# EAGLE board MainBoard (EAGLE 9.7.0)
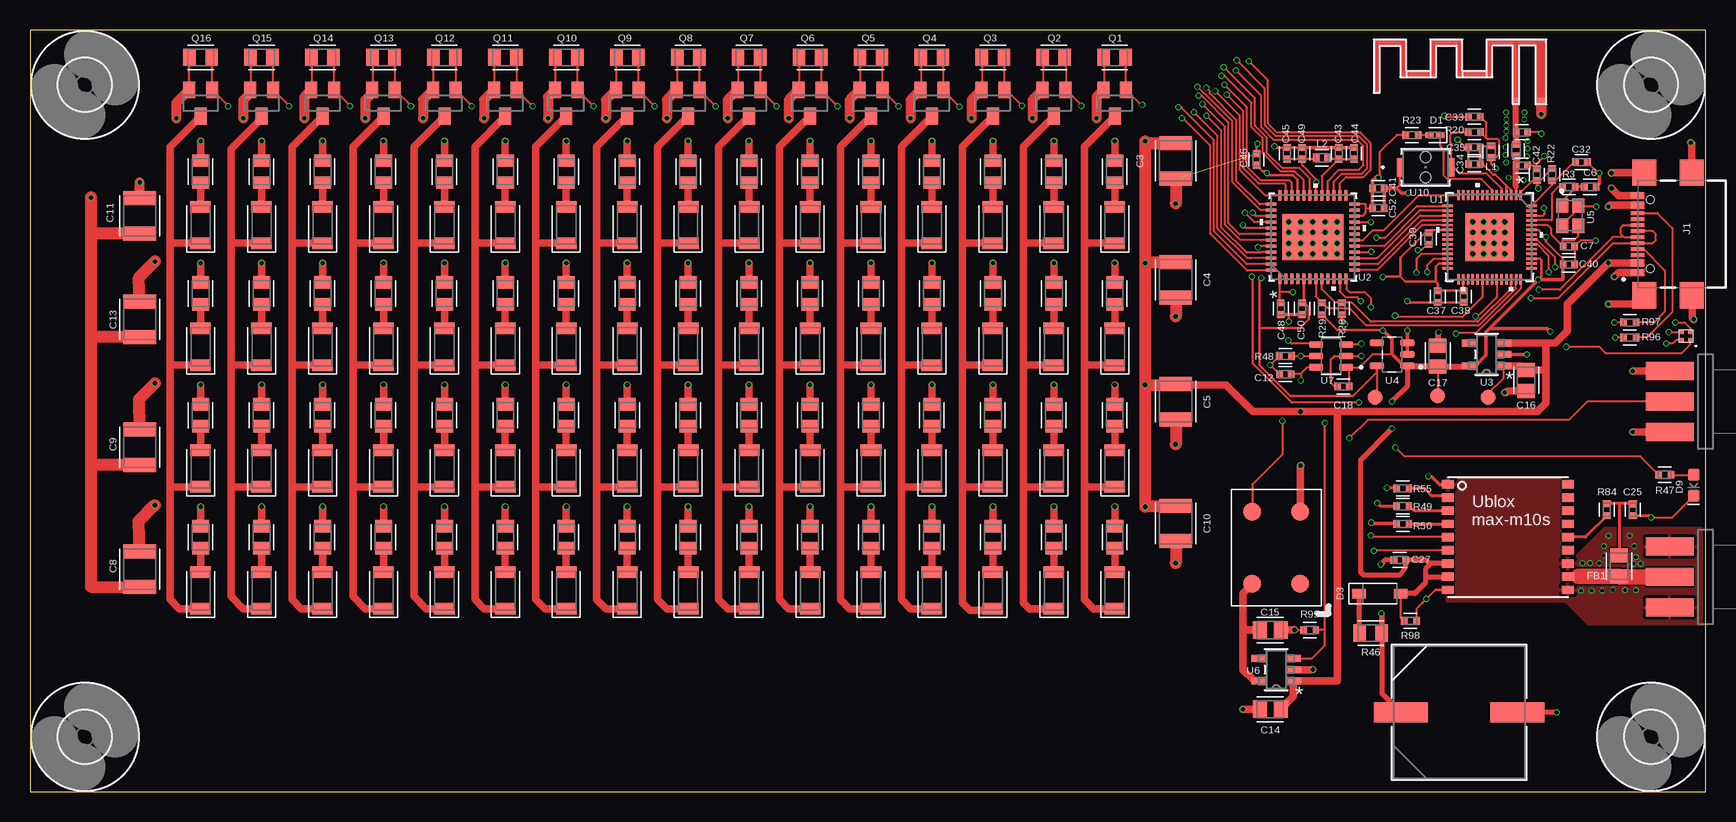
[diagram p2: board, top side]
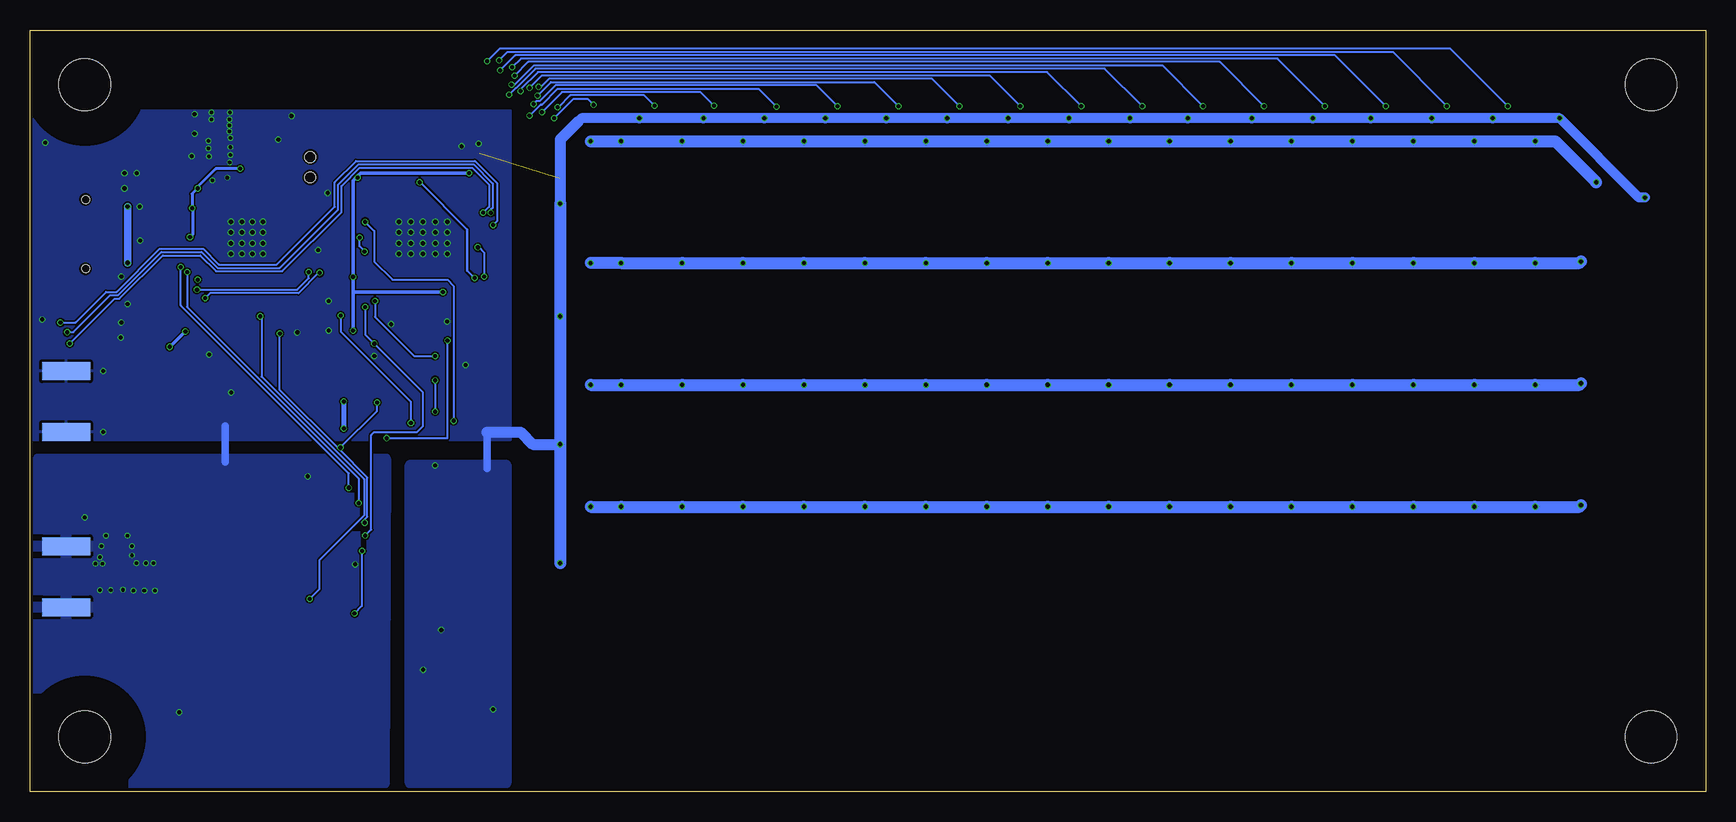
[diagram p3: board, bottom side, seen from below]

Size 139.7 x 63.5 mm. Coordinates in mm from the lower left corner, seen from the top.
Outline: 139.7,63.5 0,63.5 0,0 139.7,0 139.7,63.5
Copper layers (1*16): Top 0.035mm / dielectric 1.6mm / Bottom 0.035mm
Design rules "jlcpcb-2layers.dru": minimum track width 5mil, minimum drill 0.3mm, track to track 5mil, track to pad 5mil, pad to pad 5mil, via to via 5mil, smd to smd 5mil, copper to edge 0.2mm, drill to drill 6mil, minimum pad ring 10mil, minimum via ring 3mil, stop-mask expansion 4mil, vias tented up to drill 0mil, thermal gap 10mil

## Footprints (pad centres in the part's own frame; a part is rotated, then mirrored left to right if it is on the bottom)
CAPC1005X60 = smd 0.56 x 0.629: 1 -0.485,0; 2 0.485,0
CAPC3225X135 = smd 1.165 x 2.715: 1 -1.475,0; 2 1.475,0
CAPC2012X110 = smd 1.165 x 1.465: 1 -0.875,0; 2 0.875,0
FC0H473ZFTBR24_KEM = smd 4.496 x 1.702: 1 -4.864,0; 2 4.864,0
LEDC1005X25N_FLAT-B = smd 0.7 x 0.5: A 0.45,0; C -0.45,0
LEDC3216X180N_RND-B = smd 0.962 x 1.712: A 1.525,0; C -1.525,0
SOD3715X135 = smd 1.127 x 0.784: 1 -1.722,0; 2 1.722,0
LED-0603 = smd 1 x 1: A -0.877,0; C 0.877,0
SMA-EDGE = smd 1.5 x 4: GND@0 -2.54,0; GND@1 2.54,0; SIG 0,0 | smd 1.5 x 4 bottom: GND@2 -2.54,0; GND@3 2.54,0
BEADC2012X105N = smd 1.165 x 1.465: 1 -0.875,0; 2 0.875,0
4,3 = hole 4.3: 0,0
GCT_USB4110GFA = smd 0.6 x 1.15: A1/B12 -3.2,1.075; A4/B9 -2.4,1.075; B1/A12 3.2,1.075; B4/A9 2.4,1.075 | smd 0.3 x 1.15: A5 -1.25,1.075; A6 -0.25,1.075; A7 0.25,1.075; A8 1.25,1.075; B5 1.75,1.075; B6 0.75,1.075; B7 -0.75,1.075; B8 -1.75,1.075 | smd 2.18 x 2: S1 -5.11,0.5; S2 5.11,0.5; S3 -5.11,-3.43; S4 5.11,-3.43 | hole 0.65: -2.89,0; 2.89,0
INDC1006X60N = smd 0.56 x 0.729: 1 -0.485,0; 2 0.485,0
SOT23 = smd 1 x 1.4: 1 -0.95,-1.1; 2 0.95,-1.1; 3 0,1.1
RESC2012X65 = smd 1.031 x 1.42: 1 -0.919,0; 2 0.919,0
RESC1005X40 = smd 0.535 x 0.644: 1 -0.507,0; 2 0.507,0
B1,27 = smd 1.27 x 1.27: TP 0,0
QFN56_ESP32-S2FH4_EXP-M = smd 0.864 x 0.203: 1 -3.505,2.6; 2 -3.505,2.2; 3 -3.505,1.8; 4 -3.505,1.4; 5 -3.505,1; 6 -3.505,0.6; 7 -3.505,0.2; 8 -3.505,-0.2; 9 -3.505,-0.6; 10 -3.505,-1; 11 -3.505,-1.4; 12 -3.505,-1.8; 13 -3.505,-2.2; 14 -3.505,-2.6; 29 3.505,-2.6; 30 3.505,-2.2; 31 3.505,-1.8; 32 3.505,-1.4; 33 3.505,-1; 34 3.505,-0.6; 35 3.505,-0.2; 36 3.505,0.2; 37 3.505,0.6; 38 3.505,1; 39 3.505,1.4; 40 3.505,1.8; 41 3.505,2.2; 42 3.505,2.6 | smd 0.203 x 0.864: 15 -2.6,-3.505; 16 -2.2,-3.505; 17 -1.8,-3.505; 18 -1.4,-3.505; 19 -1,-3.505; 20 -0.6,-3.505; 21 -0.2,-3.505; 22 0.2,-3.505; 23 0.6,-3.505; 24 1,-3.505; 25 1.4,-3.505; 26 1.8,-3.505; 27 2.2,-3.505; 28 2.6,-3.505; 43 2.6,3.505; 44 2.2,3.505; 45 1.8,3.505; 46 1.4,3.505; 47 1,3.505; 48 0.6,3.505; 49 0.2,3.505; 50 -0.2,3.505; 51 -0.6,3.505; 52 -1,3.505; 53 -1.4,3.505; 54 -1.8,3.505; 55 -2.2,3.505; 56 -2.6,3.505 | smd 4.039 x 4.039: 57 0,0
ICE40-QFN = smd 0.864 x 0.254: 1 -3.48,2.75; 2 -3.48,2.25; 3 -3.48,1.75; 4 -3.48,1.25; 5 -3.48,0.75; 6 -3.48,0.25; 7 -3.48,-0.25; 8 -3.48,-0.75; 9 -3.48,-1.25; 10 -3.48,-1.75; 11 -3.48,-2.25; 12 -3.48,-2.75; 25 3.48,-2.75; 26 3.48,-2.25; 27 3.48,-1.75; 28 3.48,-1.25; 29 3.48,-0.75; 30 3.48,-0.25; 31 3.48,0.25; 32 3.48,0.75; 33 3.48,1.25; 34 3.48,1.75; 35 3.48,2.25; 36 3.48,2.75 | smd 0.254 x 0.864: 13 -2.75,-3.48; 14 -2.25,-3.48; 15 -1.75,-3.48; 16 -1.25,-3.48; 17 -0.75,-3.48; 18 -0.25,-3.48; 19 0.25,-3.48; 20 0.75,-3.48; 21 1.25,-3.48; 22 1.75,-3.48; 23 2.25,-3.48; 24 2.75,-3.48; 37 2.75,3.48; 38 2.25,3.48; 39 1.75,3.48; 40 1.25,3.48; 41 0.75,3.48; 42 0.25,3.48; 43 -0.25,3.48; 44 -0.75,3.48; 45 -1.25,3.48; 46 -1.75,3.48; 47 -2.25,3.48; 48 -2.75,3.48 | smd 3.81 x 5.08: PAD 0,0
TSOP5_3X1P5_ONS-M = smd 1.233 x 0.559: 1 -1.442,0.95; 2 -1.442,0; 3 -1.442,-0.95; 4 1.442,-0.95; 5 1.442,0.95
TPS76912DBVR = smd 1.21 x 0.59: 1 -1.255,0.95; 2 -1.255,0; 3 -1.255,-0.95; 4 1.255,-0.95; 5 1.255,0.95
XTAL_ECS-400-10-36-CKY-TR = smd 1.2 x 1: GND-A -0.85,0.65; GND-B 0.85,-0.65; IN/OUT -0.85,-0.65; OUT/IN 0.85,0.65
SOT95P280X145-6N = smd 1.21 x 0.58: 1 -1.255,0.95; 2 -1.255,0; 3 -1.255,-0.95; 4 1.255,-0.95; 5 1.255,0; 6 1.255,0.95
RGBLED = smd 0.3 x 0.3: P$1 0.33,0.33; P$2 0.33,-0.33; P$3 -0.33,-0.33; P$4 -0.33,0.33
SW_CS1213AGF260_CRS = smd 0.508 x 1.524: 1 -2.159,0; 2 2.159,0 | hole 0.889: 0,0.85; 0,-0.85
MAX-M10S-00B = smd 1 x 0.7: P$1 -5,4.4; P$2 -5,3.3; P$3 -5,2.2; P$4 -5,1.1; P$5 -5,0; P$6 -5,-1.1; P$7 -5,-2.2; P$8 -5,-3.3; P$9 -5,-4.4; P$10 5,-4.4; P$11 5,-3.3; P$12 5,-2.2; P$13 5,-1.1; P$14 5,0; P$15 5,1.1; P$16 5,2.2; P$17 5,3.3; P$18 5,4.4
PCB-ANTENNA = smd 0.9 x 0.5: P$1 0.075,-1.65 | smd 0.5 x 0.5: P$2 2.175,-1.65
ACO97 = smd 1.5 x 1.5: DNC -3,-2; GND 3,-2; OUT 3,2; VDD -3,2

## Placement (x,y rotation side)
C1  3.3pF  [CAPC1005X60]  124.36,52.2 0 top
C2  3.3pF  [CAPC1005X60]  124.36,54.97 0 top
C3  22uF  [CAPC3225X135]  95.5,52.58 270 top
C4  22uF  [CAPC3225X135]  95.5,42.67 270 top
C5  22uF  [CAPC3225X135]  95.5,32.51 270 top
C6  12pF  [CAPC1005X60]  130.05,50.42 0 top
C7  12pF  [CAPC1005X60]  128.27,45.47 0 top
C8  22uF  [CAPC3225X135]  9.14,18.54 270 top
C9  22uF  [CAPC3225X135]  9.14,28.7 270 top
C10  22uF  [CAPC3225X135]  95.5,22.35 270 top
C11  22uF  [CAPC3225X135]  9.14,48.01 270 top
C12  1uF  [CAPC1005X60]  104.65,34.8 180 top
C13  22uF  [CAPC3225X135]  9.14,39.37 270 top
C14  1uF  [CAPC2012X110]  103.38,6.86 180 top
C15  1uF  [CAPC2012X110]  103.38,13.46 0 top
C16  1uF  [CAPC2012X110]  124.71,34.29 270 top
C17  1uF  [CAPC2012X110]  117.35,36.32 90 top
C18  1uF  [CAPC1005X60]  109.47,33.78 180 top
C20  FC0H473ZFTBR24FC0H473ZFTBR24_KEM  [FC0H473ZFTBR24_KEM]  119.13,6.6 0 top
C25  47pF  [CAPC1005X60]  133.6,23.5 270 top
C27  4.7uF  [CAPC1005X60]  114.17,19.3 180 top
C32  1uF  [CAPC1005X60]  129.32,52.49 0 top
C33  10uF  [CAPC1005X60]  120.4,56.26 180 top
C34  10uF  [CAPC1005X60]  120.4,52.32 180 top
C35  0.1uF  [CAPC1005X60]  120.4,53.72 180 top
C37  0.1uF  [CAPC1005X60]  117.35,41.27 270 top
C38  0.1uF  [CAPC1005X60]  119.51,41.27 270 top
C39  0.1uF  [CAPC1005X60]  116.59,46.1 270 top
C40  0.1uF  [CAPC1005X60]  128.27,43.94 0 top
C41  0.1uF  [CAPC1005X60]  112.39,50.29 0 top
C42  0.1uF  [CAPC1005X60]  125.6,51.44 90 top
C43  10uF  [CAPC1005X60]  109.09,53.21 90 top
C44  0.1uF  [CAPC1005X60]  110.36,53.21 90 top
C45  10uF  [CAPC1005X60]  104.78,53.21 90 top
C46  0.1uF  [CAPC1005X60]  102.23,52.7 90 top
C48  0.1uF  [CAPC1005X60]  104.27,40.26 270 top
C49  0.1uF  [CAPC1005X60]  106.05,53.21 90 top
C50  0.1uF  [CAPC1005X60]  106.05,40.26 270 top
C52  0.1uF  [CAPC1005X60]  112.39,48.64 0 top
D1  LED_BLUE  [LEDC1005X25N_FLAT-B]  117.09,54.74 180 top
D2  LED_BLUE  [LEDC3216X180N_RND-B]  39.62,47.24 90 top
D3  1N4148W  [SOD3715X135]  112.52,16.51 0 top
D4  LED_BLUE  [LEDC3216X180N_RND-B]  90.42,47.24 90 top
D5  LED_BLUE  [LEDC3216X180N_RND-B]  90.42,37.08 90 top
D6  LED_BLUE  [LEDC3216X180N_RND-B]  90.42,26.92 90 top
D7  LED_BLUE  [LEDC3216X180N_RND-B]  90.42,16.76 90 top
D8  LED_BLUE  [LEDC3216X180N_RND-B]  39.62,37.08 90 top
D9  [LED-0603]  138.68,25.53 270 top
D10  LED_BLUE  [LEDC3216X180N_RND-B]  39.62,26.92 90 top
D11  LED_BLUE  [LEDC3216X180N_RND-B]  39.62,16.76 90 top
D12  LED_BLUE  [LEDC3216X180N_RND-B]  85.34,26.92 90 top
D13  LED_BLUE  [LEDC3216X180N_RND-B]  85.34,47.24 90 top
D14  LED_BLUE  [LEDC3216X180N_RND-B]  85.34,16.76 90 top
D15  LED_BLUE  [LEDC3216X180N_RND-B]  85.34,37.08 90 top
D16  LED_BLUE  [LEDC3216X180N_RND-B]  34.54,47.24 90 top
D17  LED_BLUE  [LEDC3216X180N_RND-B]  34.54,37.08 90 top
D18  LED_BLUE  [LEDC3216X180N_RND-B]  34.54,26.92 90 top
D19  LED_BLUE  [LEDC3216X180N_RND-B]  34.54,16.76 90 top
D20  LED_BLUE  [LEDC3216X180N_RND-B]  80.26,16.76 90 top
D21  LED_BLUE  [LEDC3216X180N_RND-B]  80.26,37.08 90 top
D22  LED_BLUE  [LEDC3216X180N_RND-B]  80.26,47.24 90 top
D23  LED_BLUE  [LEDC3216X180N_RND-B]  80.26,26.92 90 top
D24  LED_BLUE  [LEDC3216X180N_RND-B]  29.46,16.76 90 top
D25  LED_BLUE  [LEDC3216X180N_RND-B]  29.46,26.92 90 top
D26  LED_BLUE  [LEDC3216X180N_RND-B]  29.46,37.08 90 top
D27  LED_BLUE  [LEDC3216X180N_RND-B]  29.46,47.24 90 top
D28  LED_BLUE  [LEDC3216X180N_RND-B]  75.18,16.76 90 top
D29  LED_BLUE  [LEDC3216X180N_RND-B]  75.18,37.08 90 top
D30  LED_BLUE  [LEDC3216X180N_RND-B]  75.18,26.92 90 top
D31  LED_BLUE  [LEDC3216X180N_RND-B]  75.18,47.24 90 top
D32  LED_BLUE  [LEDC3216X180N_RND-B]  24.38,16.76 90 top
D33  LED_BLUE  [LEDC3216X180N_RND-B]  24.38,26.92 90 top
D34  LED_BLUE  [LEDC3216X180N_RND-B]  24.38,37.08 90 top
D35  LED_BLUE  [LEDC3216X180N_RND-B]  24.38,47.24 90 top
D36  LED_BLUE  [LEDC3216X180N_RND-B]  70.1,26.92 90 top
D37  LED_BLUE  [LEDC3216X180N_RND-B]  70.1,16.76 90 top
D38  LED_BLUE  [LEDC3216X180N_RND-B]  70.1,37.08 90 top
D39  LED_BLUE  [LEDC3216X180N_RND-B]  70.1,47.24 90 top
D40  LED_BLUE  [LEDC3216X180N_RND-B]  19.3,37.08 90 top
D41  LED_BLUE  [LEDC3216X180N_RND-B]  19.3,16.76 90 top
D42  LED_BLUE  [LEDC3216X180N_RND-B]  19.3,26.92 90 top
D43  LED_BLUE  [LEDC3216X180N_RND-B]  19.3,47.24 90 top
D44  LED_BLUE  [LEDC3216X180N_RND-B]  65.02,47.24 90 top
D45  LED_BLUE  [LEDC3216X180N_RND-B]  65.02,37.08 90 top
D46  LED_BLUE  [LEDC3216X180N_RND-B]  65.02,26.92 90 top
D47  LED_BLUE  [LEDC3216X180N_RND-B]  65.02,16.76 90 top
D48  LED_BLUE  [LEDC3216X180N_RND-B]  14.22,16.76 90 top
D49  LED_BLUE  [LEDC3216X180N_RND-B]  14.22,37.08 90 top
D50  LED_BLUE  [LEDC3216X180N_RND-B]  14.22,26.92 90 top
D51  LED_BLUE  [LEDC3216X180N_RND-B]  14.22,47.24 90 top
D52  LED_BLUE  [LEDC3216X180N_RND-B]  59.94,47.24 90 top
D53  LED_BLUE  [LEDC3216X180N_RND-B]  59.94,37.08 90 top
D54  LED_BLUE  [LEDC3216X180N_RND-B]  59.94,26.92 90 top
D55  LED_BLUE  [LEDC3216X180N_RND-B]  59.94,16.76 90 top
D60  LED_BLUE  [LEDC3216X180N_RND-B]  54.86,26.92 90 top
D61  LED_BLUE  [LEDC3216X180N_RND-B]  54.86,16.76 90 top
D62  LED_BLUE  [LEDC3216X180N_RND-B]  54.86,47.24 90 top
D63  LED_BLUE  [LEDC3216X180N_RND-B]  54.86,37.08 90 top
D68  LED_BLUE  [LEDC3216X180N_RND-B]  49.78,16.76 90 top
D69  LED_BLUE  [LEDC3216X180N_RND-B]  49.78,26.92 90 top
D70  LED_BLUE  [LEDC3216X180N_RND-B]  49.78,37.08 90 top
D71  LED_BLUE  [LEDC3216X180N_RND-B]  49.78,47.24 90 top
D76  LED_BLUE  [LEDC3216X180N_RND-B]  44.7,26.92 90 top
D77  LED_BLUE  [LEDC3216X180N_RND-B]  44.7,37.08 90 top
D78  LED_BLUE  [LEDC3216X180N_RND-B]  44.7,16.76 90 top
D79  LED_BLUE  [LEDC3216X180N_RND-B]  44.7,47.24 90 top
E1  ANTENNA-SMA-GROUNDEDEDGE_SMA  [SMA-EDGE]  136.68,17.91 270 top
E2  ANTENNA-SMA-GROUNDEDEDGE_SMA  [SMA-EDGE]  136.68,32.51 270 top
FB1  BLM21AG102  [BEADC2012X105N]  132.46,18.8 90 top
H5  MOUNT-HOLE4.3  [4,3]  4.57,4.57 0 top
H6  MOUNT-HOLE4.3  [4,3]  4.57,58.93 0 top
H7  MOUNT-HOLE4.3  [4,3]  135.13,4.57 0 top
H8  MOUNT-HOLE4.3  [4,3]  135.13,58.93 0 top
J1  USB4110GFA  [GCT_USB4110GFA]  135.07,46.48 90 top
L1  1nH 70mOhm  [INDC1006X60N]  121.79,53.34 90 top
L2  1nH 70mOhm  [INDC1006X60N]  107.7,52.83 0 top
L3  2.2nH  [INDC1006X60N]  123.88,53.47 90 top
Q1  NMOSFET  [SOT23]  90.42,57.4 180 top
Q2  NMOSFET  [SOT23]  85.34,57.4 180 top
Q3  NMOSFET  [SOT23]  80.26,57.4 180 top
Q4  NMOSFET  [SOT23]  75.18,57.4 180 top
Q5  NMOSFET  [SOT23]  70.1,57.4 180 top
Q6  NMOSFET  [SOT23]  65.02,57.4 180 top
Q7  NMOSFET  [SOT23]  59.94,57.4 180 top
Q8  NMOSFET  [SOT23]  54.86,57.4 180 top
Q9  NMOSFET  [SOT23]  49.78,57.4 180 top
Q10  NMOSFET  [SOT23]  44.7,57.4 180 top
Q11  NMOSFET  [SOT23]  39.62,57.4 180 top
Q12  NMOSFET  [SOT23]  34.54,57.4 180 top
Q13  NMOSFET  [SOT23]  29.46,57.4 180 top
Q14  NMOSFET  [SOT23]  24.38,57.4 180 top
Q15  NMOSFET  [SOT23]  19.3,57.4 180 top
Q16  NMOSFET  [SOT23]  14.22,57.4 180 top
R1  10k  [RESC2012X65]  90.42,61.21 0 top
R2  [RESC2012X65]  39.62,51.69 90 top
R3  0  [RESC1005X40]  128.27,50.42 0 top
R4  10k  [RESC2012X65]  75.18,61.21 180 top
R5  10k  [RESC2012X65]  70.1,61.21 180 top
R6  [RESC2012X65]  90.42,51.69 90 top
R7  [RESC2012X65]  90.42,41.53 90 top
R8  [RESC2012X65]  90.42,31.37 90 top
R9  [RESC2012X65]  90.42,21.21 90 top
R10  10k  [RESC2012X65]  65.02,61.21 180 top
R11  10k  [RESC2012X65]  59.94,61.21 180 top
R12  10k  [RESC2012X65]  85.34,61.21 0 top
R13  10k  [RESC2012X65]  54.86,61.21 180 top
R14  10k  [RESC2012X65]  49.78,61.21 180 top
R15  [RESC2012X65]  85.34,31.37 90 top
R16  [RESC2012X65]  85.34,51.69 90 top
R17  [RESC2012X65]  85.34,21.21 90 top
R18  [RESC2012X65]  85.34,41.53 90 top
R19  10k  [RESC2012X65]  44.7,61.21 180 top
R20  10k  [RESC1005X40]  120.4,54.99 0 top
R21  10k  [RESC2012X65]  80.26,61.21 180 top
R22  10k  [RESC1005X40]  126.87,51.44 90 top
R23  1k  [RESC1005X40]  115.19,54.74 0 top
R24  [RESC2012X65]  80.26,21.21 90 top
R25  [RESC2012X65]  80.26,41.53 90 top
R26  [RESC2012X65]  80.26,51.69 90 top
R27  [RESC2012X65]  80.26,31.37 90 top
R28  10k  [RESC1005X40]  109.35,40.26 90 top
R29  10k  [RESC1005X40]  107.7,40.26 270 top
R30  [RESC2012X65]  39.62,41.53 90 top
R31  [RESC2012X65]  39.62,31.37 90 top
R32  [RESC2012X65]  39.62,21.21 90 top
R33  [RESC2012X65]  75.18,21.21 90 top
R34  [RESC2012X65]  75.18,41.53 90 top
R35  [RESC2012X65]  75.18,31.37 90 top
R36  [RESC2012X65]  75.18,51.69 90 top
R37  [RESC2012X65]  34.54,51.69 90 top
R38  [RESC2012X65]  34.54,41.53 90 top
R39  [RESC2012X65]  34.54,31.37 90 top
R40  [RESC2012X65]  34.54,21.21 90 top
R41  [RESC2012X65]  29.46,21.21 90 top
R42  [RESC2012X65]  70.1,31.37 90 top
R43  [RESC2012X65]  70.1,21.21 90 top
R44  [RESC2012X65]  70.1,41.53 90 top
R45  [RESC2012X65]  70.1,51.69 90 top
R46  [RESC2012X65]  111.76,13.21 180 top
R47  1k  [RESC1005X40]  136.27,26.42 180 top
R48  10k  [RESC1005X40]  104.65,36.32 180 top
R49  33  [RESC1005X40]  114.43,23.79 0 top
R50  33  [RESC1005X40]  114.43,22.31 0 top
R51  [RESC2012X65]  65.02,51.69 90 top
R52  [RESC2012X65]  65.02,41.53 90 top
R53  [RESC2012X65]  65.02,31.37 90 top
R54  [RESC2012X65]  65.02,21.21 90 top
R55  33  [RESC1005X40]  114.43,25.27 0 top
R56  [RESC2012X65]  29.46,31.37 90 top
R57  [RESC2012X65]  29.46,41.53 90 top
R58  [RESC2012X65]  29.46,51.69 90 top
R59  [RESC2012X65]  24.38,21.21 90 top
R60  [RESC2012X65]  59.94,51.69 90 top
R61  [RESC2012X65]  59.94,41.53 90 top
R62  [RESC2012X65]  59.94,31.37 90 top
R63  [RESC2012X65]  59.94,21.21 90 top
R64  [RESC2012X65]  24.38,31.37 90 top
R65  [RESC2012X65]  24.38,41.53 90 top
R66  [RESC2012X65]  24.38,51.69 90 top
R67  10k  [RESC2012X65]  39.62,61.21 180 top
R68  10k  [RESC2012X65]  34.54,61.21 180 top
R69  [RESC2012X65]  54.86,31.37 90 top
R70  [RESC2012X65]  54.86,21.21 90 top
R71  [RESC2012X65]  54.86,51.69 90 top
R72  [RESC2012X65]  54.86,41.53 90 top
R73  10k  [RESC2012X65]  29.46,61.21 180 top
R74  10k  [RESC2012X65]  24.38,61.21 180 top
R75  [RESC2012X65]  19.3,41.53 90 top
R76  [RESC2012X65]  19.3,21.21 90 top
R77  [RESC2012X65]  19.3,31.37 90 top
R78  [RESC2012X65]  49.78,21.21 90 top
R79  [RESC2012X65]  49.78,31.37 90 top
R80  [RESC2012X65]  49.78,41.53 90 top
R81  [RESC2012X65]  49.78,51.69 90 top
R82  [RESC2012X65]  19.3,51.69 90 top
R83  10k  [RESC2012X65]  19.3,61.21 180 top
R84  33  [RESC1005X40]  131.44,23.5 90 top
R85  [RESC2012X65]  14.22,21.21 90 top
R86  [RESC2012X65]  14.22,41.53 90 top
R87  [RESC2012X65]  44.7,31.37 90 top
R88  [RESC2012X65]  44.7,41.53 90 top
R89  [RESC2012X65]  44.7,21.21 90 top
R90  [RESC2012X65]  44.7,51.69 90 top
R91  [RESC2012X65]  14.22,31.37 90 top
R92  [RESC2012X65]  14.22,51.69 90 top
R93  10k  [RESC2012X65]  14.22,61.21 180 top
R96  5.1k  [RESC1005X40]  133.35,37.85 0 top
R97  5.1k  [RESC1005X40]  133.35,39.12 0 top
R98  10k  [RESC1005X40]  115.06,14.22 0 top
R99  10k  [RESC1005X40]  106.68,13.46 0 top
TP20  TPSB1,27  [B1,27]  121.54,32.89 180 top
TP21  TPSB1,27  [B1,27]  117.35,33.02 180 top
TP22  TPSB1,27  [B1,27]  112.14,32.89 180 top
U1  ESP32  [QFN56_ESP32-S2FH4_EXP-M]  121.67,46.23 270 top
U2  ICE40  [ICE40-QFN]  106.93,46.23 90 top
U3  NCV8161ASN330T1G  [TSOP5_3X1P5_ONS-M]  121.41,36.45 180 top
U4  TPS76912DBVR  [TPS76912DBVR]  113.54,36.45 180 top
U5  CRYSTAL-OSC  [XTAL_ECS-400-10-36-CKY-TR]  128.4,48.01 270 top
U6  NCV8161ASN330T1G  [TSOP5_3X1P5_ONS-M]  103.89,10.16 180 top
U7  TXB0101DBVR  [SOT95P280X145-6N]  108.46,36.32 180 top
U9  RGBLED  [RGBLED]  138.05,37.97 270 top
U10  TS-1185-C-A-A-A  [SW_CS1213AGF260_CRS]  116.33,52.05 0 top
U11  MAX-M10S-00B  [MAX-M10S-00B]  123.19,21.21 0 top
U$1  PCB-ANTENNA  [PCB-ANTENNA]  126.03,55.96 180 top
U$2  ACO97  [ACO97]  103.89,20.32 90 top

## Tracks (layer width: path | path; a pad name or v marks a point on that pad's centre or on a via)
+1.2V  (via drill 0.35)
  Top 0.152: U2.30 107.18,50.8 107.18,51.08 106.05,52.22 C49.1 | 106.17,42.74 U2.5 | L2.1 107.11,52.73 C49.1 | C49.1 C45.1 | U4.5 112.28,32.89 TP22.TP
  Top 0.203: 106.17,42.74 106.17,40.87 C50.1 106.25,40.74 106.59,40.4 106.59,39.4 105.84,38.65 102.49,38.65 102.49,35.55 102.74,35.3 | v102.64,42.83 102.47,42.66 102.47,35.58 102.74,35.3 | 107.18,50.8 v107.23,50.8 | U4.5 112.28,34.99 110.25,32.96 105.08,32.96 103.66,34.39 102.74,35.3
  Bottom 0.203: v102.64,42.83 103.25,43.44 103.25,46.87 107.18,50.8 v107.23,50.8
+1.2V_PLL
  Top 0.152: L2.2 108.28,52.73 C43.1 107.68,51.32 U2.29
  Top 0.203: C43.1 C44.1
+3.3V  (via drill 0.35, 0.35 pad 0.25)
  Top 0.152: 119.45,41.77 C38.1 119.47,41.8 U1.30 | 104.18,40.83 104.18,41.66 | 104.18,41.66 U2.1 | 111.33,48.6 111.4,48.64 C52.1 | U2.24 111.32,48.98 111.33,48.98 111.33,48.6 | 111.33,48.6 111.33,48.26 111.07,47.99 110.43,47.99 U2.22 | v112.78,42.91 112.78,42.93 | U1.54 126.14,48.03 126.28,48.18 126.28,48.64 v126.18,48.64 | R23.1 113.92,54.74 112.52,53.34 112.52,51.31 | 125.63,50.93 C42.1 | v105.28,41.66 104.18,41.66 | C33.1 120.9,56.26 121.41,55.75 121.41,54.48 | U1.1 124.27,49.99 125.23,50.95 C42.1 | D3.2 114.24,14.54 R98.1 | C17.1 TP21.TP | C42.1 125.88,50.95 R22.2 | v122.17,51.93 121.79,52.31 L1.1 122.2,52.85 122.43,53.09 122.43,54.36 122.36,54.42 121.47,54.42 121.41,54.48 | 121.41,54.48 R20.2 | U9.P$1 138.38,37.29 137.67,36.58 131.32,36.58 130.81,37.08 v128.04,37.08 | U7.1 109.73,35.37 | 109.73,35.37 110.81,35.37 111.92,36.48 113.52,36.48 | C18.1 109.96,35.14 109.73,35.37
  Top 0.203: U1.45 125.87,44.43 125.98,44.31 125.98,42.93 v125.73,42.67 | U1.20 116.74,46.83 C39.1 116.33,46.59 114.25,44.5 114.25,42.93 | C48.1 104.18,40.83 | 112.78,42.93 114.25,42.93 | 119.45,41.77 119.45,41.76 C37.1 117.35,42.37 117.2,42.52 | 117.2,42.52 114.66,42.52 114.25,42.93 | U2.33 105.67,49.73 105.67,51.01 105.28,51.4 103.32,51.4 103.09,51.62 | C46.1 102.74,51.71 103.06,51.71 103.06,51.65 103.09,51.62 | R29.2 108.97,38.48 112.78,38.48 v112.78,38.44 | U1.51 125.77,46.83 v126.37,46.23 126.37,45.84 127.78,44.43 C40.1 | 103.09,51.62 v103.09,51.56 | 117.2,42.52 117.2,43.78 117.45,44.03 U1.27
  Top 0.254: v125.73,50.29 125.63,50.4 125.63,50.93
  Top 0.305: C52.1 C41.1 111.91,50.98 111.92,50.96 112.27,51.31 112.52,51.31 v112.4,51.18 | U4.1 114.7,35.59 114.4,35.59 113.52,36.48 113.52,37.74 112.78,38.48 | 121.67,38.61 121.36,38.3 121.36,36.38 120.48,35.5 U3.5 | 121.67,38.61 v125.73,42.67 127.76,42.67 127.78,42.7 C40.1 | 121.67,38.61 126.49,38.61 v126.75,38.35
  Top 0.406: 116.33,17.9 118.18,17.9 U11.P$8 | 116.33,17.9 116.33,17.4 115.44,16.51 D3.2 | U11.P$7 116.8,19.01 | 116.8,19.01 116.33,18.54 116.33,17.9 | 116.8,19.01 116.63,19.01 116.33,19.3 C27.1 114.66,18.7 114.19,18.03 111.17,18.03 110.92,18.29 110.92,27.66 v113.54,30.28 | U4.1 114.79,33.77 v113.54,32.51
  Top 0.508: U4.1 117.3,35.5 C17.1 119.92,35.45 U3.5
  Bottom 0.152: 126.28,48.64 126.13,48.49
  Bottom 0.254: 126.13,48.49 126.13,46.46 v126.37,46.23 | v122.17,51.93 124.22,51.93 125.73,50.42 v125.73,50.29 126.18,49.84 v126.18,48.64 126.28,48.64
  Bottom 0.305: 112.78,41.66 v112.78,42.91 112.78,50.95 112.47,51.25 | 112.78,41.66 v105.28,41.66 | v112.78,38.44 112.78,41.66 | v126.75,38.35 128.02,37.08 v128.04,37.08 | v112.4,51.18 112.47,51.25 | 112.47,51.25 112.16,51.56 v103.09,51.56
  Bottom 0.406: v113.54,32.51 v113.54,30.28
+5V  (via drill 0.35)
  Top 0.152: TP20.TP 121.54,33.17 122.85,34.48 U3.1 | U7.6 106.44,35.37 105.92,34.85 105.92,34.8 | 105.92,34.8 v105.92,34.29 | 105.92,34.8 C12.1
  Top 0.61: 126.36,35.16 126.36,37.27 126.24,37.4 | 126.36,35.16 126.36,32.38 125.65,31.67 108.97,31.67 | v131.57,48.77 131.69,48.88 J1.B4/A9 | J1.A4/B9 v131.57,44.08 128.14,40.65 128.14,38.4 127.14,37.4 126.24,37.4 | 126.36,35.16 C16.1 124.38,35.5 U3.1 | 108.97,31.67 108.97,9.21 U6.1 105.33,7.93 C14.1 | 108.97,31.67 v105.92,31.67 101.93,31.67 99.69,33.91 95.43,33.91 | 126.24,37.4 U3.3
  Top 0.635: R9.2 v90.42,23.75 | R17.2 v85.34,23.75 | R24.2 v80.26,23.75 | R33.2 v75.18,23.75 | R43.2 v70.1,23.75 | R54.2 v65.02,23.75 | R63.2 v59.94,23.75 | R70.2 v54.86,23.75 | R78.2 v49.78,23.75 | R89.2 v44.7,23.75 | R32.2 v39.62,23.75 | R40.2 v34.54,23.75 | R41.2 v29.46,23.75 | R59.2 v24.38,23.75 | R76.2 v19.3,23.75 | R85.2 v14.22,23.75 | R8.2 v90.42,33.91 | R15.2 v85.34,33.91 | R27.2 v80.26,33.91 | R35.2 v75.18,33.91 | R42.2 v70.1,33.91 | R53.2 v65.02,33.91 | R62.2 v59.94,33.91 | R69.2 v54.86,33.91 | R79.2 v49.78,33.91 | R87.2 v44.7,33.91 | R31.2 v39.62,33.91 | R39.2 v34.54,33.91 | R56.2 v29.46,33.91 | R64.2 v24.38,33.91 | R77.2 v19.3,33.91 | R91.2 v14.22,33.91 | R86.2 v14.22,44.07 | R75.2 v19.3,44.07 | R65.2 v24.38,44.07 | R57.2 v29.46,44.07 | R38.2 v34.54,44.07 | R30.2 v39.62,44.07 | R88.2 v44.7,44.07 | R80.2 v49.78,44.07 | R72.2 v54.86,44.07 | R61.2 v59.94,44.07 | R52.2 v65.02,44.07 | R44.2 v70.1,44.07 | R34.2 v75.18,44.07 | R25.2 v80.26,44.07 | R18.2 v85.34,44.07 | R7.2 v90.42,44.07 | R6.2 v90.42,54.23 | R16.2 v85.34,54.23 | R26.2 v80.26,54.23 | R36.2 v75.18,54.23 | R45.2 v70.1,54.23 | R51.2 v65.02,54.23 | R60.2 v59.94,54.23 | R71.2 v54.86,54.23 | R81.2 v49.78,54.23 | R90.2 v44.7,54.23 | R2.2 v39.62,54.23 | R37.2 v34.54,54.23 | R58.2 v29.46,54.23 | R66.2 v24.38,54.23 | R82.2 v19.3,54.23 | v14.22,54.23 R92.2
  Top 0.813: C11.1 v9.14,50.8
  Top 1.016: v92.96,33.91 v92.96,23.75 93.04,23.83 C10.1 | v92.96,33.91 v92.96,44.07 | v92.96,44.07 v92.96,54.23 93.14,54.05 C3.1 | C13.1 9.06,42.85 v10.41,44.2 | C9.1 9.1,32.72 v10.41,34.04 | C8.1 9.06,22.52 v10.41,23.88 | v92.96,33.91 95.43,33.91 C5.1 | v92.96,44.07 93.04,44.15 C4.1
  Bottom 0.152: v105.92,34.29 v105.92,31.67
  Bottom 0.61: v131.57,48.77 v131.57,44.08
  Bottom 1.016: v92.96,23.75 v90.42,23.75 v85.34,23.75 v80.26,23.75 v75.18,23.75 v70.1,23.75 v65.02,23.75 v59.94,23.75 v54.86,23.75 v49.78,23.75 v44.7,23.75 v39.62,23.75 v34.54,23.75 v29.46,23.75 v24.38,23.75 v19.3,23.75 v14.22,23.75 10.54,23.75 v10.41,23.88 | v92.96,33.91 v90.42,33.91 v85.34,33.91 v80.26,33.91 v75.18,33.91 v70.1,33.91 v65.02,33.91 v59.94,33.91 v54.86,33.91 v49.78,33.91 v44.7,33.91 v39.62,33.91 v34.54,33.91 v29.46,33.91 v24.38,33.91 v19.3,33.91 v14.22,33.91 10.54,33.91 v10.41,34.04 | v92.96,44.07 v90.42,44.07 v85.34,44.07 v80.26,44.07 v75.18,44.07 v70.1,44.07 v65.02,44.07 v59.94,44.07 v54.86,44.07 v49.78,44.07 v44.7,44.07 v39.62,44.07 v34.54,44.07 v29.46,44.07 v24.38,44.07 v19.3,44.07 v14.22,44.07 10.54,44.07 v10.41,44.2 | v92.96,54.23 v90.42,54.23 v85.34,54.23 v80.26,54.23 v75.18,54.23 v70.1,54.23 v65.02,54.23 v59.94,54.23 v54.86,54.23 v49.78,54.23 v44.7,54.23 v39.62,54.23 v34.54,54.23 v29.46,54.23 v24.38,54.23 v19.3,54.23 v14.22,54.23 12.57,54.23 v9.14,50.8
ANTENNA
  Top 0.508: C2.1 | C2.1 U$1.P$2 | L3.2 123.86,53.97 C2.1
BIT0  (via drill 0.35)
  Top 0.152: U2.48 103.41,43.43 101.47,43.43 98.39,46.52 98.39,53.85 96.1,56.13 v96.01,56.13 | R1.2 91.37,61.18 Q1.1 91.37,58.49 92.61,57.25 v92.71,57.25
  Bottom 0.152: v96.01,56.13 94.38,57.76 93.22,57.76 v92.71,57.25
BIT1  (via drill 0.35)
  Top 0.152: U2.47 101.44,43.98 98.69,46.72 98.69,54.33 96,57.03 95.76,57.03 v95.73,57.06 | v87.63,57.18 87.63,57.22 86.35,58.5 Q2.1 86.36,58.57 86.36,61.21 R12.2
  Bottom 0.152: v87.63,57.18 88.49,58.04 94.67,58.04 95.66,57.06 v95.73,57.06
BIT2  (via drill 0.35)
  Top 0.152: U2.46 101.74,44.48 101.72,44.46 101.49,44.46 99,46.95 99,54.67 v97.03,56.64 | R21.1 81.18,58.53 Q3.1 81.35,58.5 v82.68,57.18
  Bottom 0.152: v82.68,57.18 83.82,58.32 95.35,58.32 v97.03,56.64
BIT3  (via drill 0.35)
  Top 0.152: v98.07,56.35 99.3,55.11 99.3,47.04 101.42,44.92 102.56,44.92 102.61,44.98 U2.45 | R4.1 76.1,58.53 Q4.1 76.13,58.44 v77.47,57.1
  Bottom 0.152: v98.07,56.35 97.13,57.29 97.03,57.29 95.72,58.6 78.97,58.6 v77.47,57.1
BIT4  (via drill 0.35)
  Top 0.152: U2.43 102.63,45.98 102.62,45.98 100.89,45.98 99.61,47.27 99.61,55.45 v97.73,57.33 | R5.1 71.02,58.53 Q5.1 71.05,58.49 v72.39,57.15
  Bottom 0.152: v97.73,57.33 97.49,57.57 97.21,57.57 95.9,58.88 74.12,58.88 v72.39,57.15
BIT5  (via drill 0.35)
  Top 0.152: U2.42 100.83,46.48 99.91,47.39 99.91,55.79 97.76,57.94 97.74,57.94 97.66,58.02 v97.4,58.02 | R10.1 65.94,58.53 Q6.1 65.97,58.49 v67.31,57.15
  Bottom 0.152: v97.4,58.02 96.26,59.16 69.32,59.16 v67.31,57.15
BIT6  (via drill 0.35)
  Top 0.152: U2.38 102.56,48.48 100.22,50.82 100.22,55.88 97.88,58.22 97.86,58.22 97.42,58.65 v97.31,58.75 | R11.1 60.86,58.53 Q7.1 60.89,58.49 v62.23,57.15
  Bottom 0.152: v62.23,57.15 64.52,59.44 96.43,59.44 97.11,58.75 v97.31,58.75
BIT7  (via drill 0.35)
  Top 0.152: U2.37 102.5,48.98 100.57,50.91 100.57,55.99 98.34,58.22 98.34,58.38 v98.04,58.67 | R13.1 55.78,58.53 Q8.1 55.81,58.49 v57.15,57.15
  Bottom 0.152: v98.04,58.67 97,59.72 59.72,59.72 v57.15,57.15
BIT8  (via drill 0.35)
  Top 0.152: U2.36 102.97,49.71 100.85,51.82 100.85,56.35 v98.8,58.41 | R14.1 50.7,58.53 Q9.1 50.73,58.49 v52.07,57.15
  Bottom 0.152: v98.8,58.41 98.8,58.57 97.36,60 54.92,60 v52.07,57.15
BIT9  (via drill 0.35)
  Top 0.152: U2.35 104.68,50.6 104.61,50.67 102.43,50.67 101.13,51.97 101.13,56.72 v99.75,58.1 | v46.99,57.15 45.65,58.49 Q10.1 45.65,61.18 R19.1
  Bottom 0.152: v99.75,58.1 99.2,58.65 97.57,60.28 50.12,60.28 v46.99,57.15
BIT10  (via drill 0.35)
  Top 0.152: U2.34 105.18,50.77 105,50.95 102.58,50.95 101.45,52.09 101.45,57.05 v99.57,58.93 | R67.1 40.54,58.53 Q11.1 40.57,58.49 v41.91,57.15
  Bottom 0.152: v99.57,58.93 99.31,58.93 97.69,60.56 45.32,60.56 v41.91,57.15
BIT11  (via drill 0.35)
  Top 0.152: U2.32 106.17,50.97 105.44,51.7 104.27,51.7 102.76,53.21 102.76,54.48 101.83,55.41 101.83,57.43 99.57,59.69 v99.31,59.69 | R68.1 35.46,58.53 Q12.1 36.83,57.17 v36.83,57.15
  Bottom 0.152: v36.83,57.15 40.52,60.84 98.17,60.84 v99.31,59.69
BIT12  (via drill 0.35)
  Top 0.152: v99.5,60.38 99.52,60.38 102.11,57.8 102.11,55.53 103.12,54.51 103.12,53.24 104.38,51.99 105.8,51.99 106.68,51.11 U2.31 | R73.1 30.38,58.53 Q13.1 31.75,57.17 v31.75,57.15
  Bottom 0.152: v31.75,57.15 35.72,61.12 98.77,61.12 v99.5,60.38
BIT13  (via drill 0.35)
  Top 0.152: U2.28 108.18,50.91 109.12,51.84 110.77,51.84 111.16,52.23 111.16,53.82 110.64,54.33 103.7,54.33 102.64,55.39 102.64,58.01 v100.52,60.13 | R74.1 25.3,58.53 Q14.1 26.67,57.17 v26.67,57.15
  Bottom 0.152: v26.67,57.15 30.91,61.4 99.25,61.4 v100.52,60.13
BIT14  (via drill 0.35)
  Top 0.152: U2.27 108.68,50.85 109.37,51.53 111.03,51.53 111.47,51.97 111.47,53.95 110.77,54.64 103.86,54.64 102.92,55.58 102.92,58.62 v100.58,60.96 | v21.59,57.15 21.59,57.17 Q15.1 20.25,61.18 R83.1
  Bottom 0.152: v100.58,60.96 99.87,61.67 26.11,61.67 v21.59,57.15
BIT15  (via drill 0.35)
  Top 0.152: U2.26 109.18,50.73 109.69,51.23 111.15,51.23 111.77,51.85 111.77,54.07 110.9,54.94 103.95,54.94 103.2,55.69 103.2,59.31 v101.6,60.91 | R93.1 15.17,61.18 Q16.1 16.51,57.17 v16.51,57.15
  Bottom 0.152: v16.51,57.15 21.31,61.95 100.55,61.95 v101.6,60.91
CDONE
  Top 0.152: U2.7 107.18,41.28 R29.1 108.17,40.3 109.96,40.3 111.36,38.89 120.81,38.89 123.87,41.95 U1.41
CHIP_PU
  Top 0.152: U1.56 125.17,48.84 126.87,50.55 R22.1 127.13,50.93 128.69,52.49 C32.1
CPU_LED
  Top 0.152: U1.7 121.87,50.19 120.99,51.06 118.14,51.06 117.87,51.34 117.87,53.54 117.54,53.87 D1.C
CRESET_B
  Top 0.152: U2.8 107.68,41.89 108.81,40.77 R28.2 109.36,40.76 110.18,40.76 111.77,39.17 120.69,39.17 123.47,41.94 U1.40
EXT_5  (via drill 0.35)
  Top 0.152: E2.SIG 129.79,32.51 128.27,30.99 111.51,30.99 v109.98,29.46 | v104.9,37.59 105.16,37.34 107.14,37.34 U7.4
  Bottom 0.152: v109.98,29.46 104.9,29.46 v104.9,37.59
EXT_33  (via drill 0.35)
  Top 0.152: U2.12 109.73,42.7 109.73,41.91 109.98,41.66 111.25,41.66 111.76,41.15 v111.76,40.39 | v111,37.34 110.93,37.27 U7.3 | U11.P$5 111.89,21.21
  Top 0.254: 111.89,21.21 v111.76,21.34
  Bottom 0.152: v111.76,40.39 111.76,38.1 v111,37.34 106.93,33.27 106.93,30.48 107.44,29.97 111,29.97 111.25,29.72 111.25,21.84 v111.76,21.34
EXT_EN  (via drill 0.35)
  Top 0.152: U2.11 109.18,41.69 109.64,41.24 110.61,41.24 v110.95,40.89 | U7.5 v105.92,36.32 R48.1
  Bottom 0.152: v110.95,40.89 110.95,39.58 107.7,36.32 v105.92,36.32
FSPI_CLK
  Top 0.152: U2.15 111.17,44.48 111.19,44.46 112.29,44.46 115.86,48.03 U1.17
FSPI_CS  (via drill 0.35)
  Top 0.152: U2.16 111.73,44.98 111.78,45.02 v111.82,45.02 | U1.15 115.61,48.83 112.97,46.19 v112.23,46.19
  Bottom 0.152: v112.23,46.19 112.23,45.47 111.82,45.07 v111.82,45.02
FSPI_HD
  Top 0.152: U1.14 115.78,49.73 112.85,46.8 111.94,46.8 111.12,45.98 U2.18
FSPI_MISO
  Top 0.152: U2.14 112.35,43.98 116,47.63 U1.18
FSPI_MOSI
  Top 0.152: U2.17 112.88,45.48 115.83,48.43 U1.16
FSPI_WP
  Top 0.152: U2.13 110.43,43.49 112.3,43.49 116.03,47.23 U1.19
GND  (via drill 0.3 pad 0.25, 0.3 pad 0.3, 0.35, 0.38)  (1 unrouted)
  Top 0.152: U5.GND-B 127.94,47.35 127.94,47.5 129.05,48.61 U5.GND-A 129.13,48.77 v130.56,48.77 | C39.2 116.46,45.62 116,45.15 v115.68,45.15 | v126.21,52.98 125.6,52.38 C42.2 125.33,52.2 C1.2 | C32.2 130.73,51.56 v130.81,51.56 | C40.2 C7.2 129.22,45.93 v130.5,45.93 | C33.2 119.89,56.29 117.95,56.29 v117.91,56.33 | 125.96,56.51 v125.98,56.49 | C2.2 125.86,54.97 125.96,54.86 v125.98,54.86 | 136.65,15.34 E1.GND@1 | v105.41,13.46 R99.1 | Q16.2 13.27,61.18 R93.2 | R83.2 18.38,58.53 Q15.2 | R74.2 23.46,58.53 Q14.2 | R73.2 28.54,58.53 Q13.2 | R68.2 33.62,58.53 Q12.2 | R67.2 38.7,58.53 Q11.2 | R19.2 43.78,58.53 Q10.2 | R12.1 84.42,58.53 Q2.2 | R21.2 79.34,58.53 Q3.2 | R4.2 74.26,58.53 Q4.2 | R5.2 69.18,58.53 Q5.2 | R10.2 64.11,58.53 Q6.2 | R11.2 59.02,58.53 Q7.2 | R13.2 53.94,58.53 Q8.2 | R14.2 48.86,58.53 Q9.2 | D9.C 136.89,22.86 v135.13,22.86 | R1.1 89.5,58.53 | R97.1 v132.08,39.12 | 104.9,39.77 104.9,39.21 v104.93,39.18 | R96.1 v132.13,37.85 | R48.2 v103.38,35.56 103.4,35.56 C12.2 | v111,36.32 U7.2 108.71,36.32 108.46,36.07 108.46,34.06 108.73,33.78 C18.2
  Top 0.203: C34.2 C35.2 119.63,53.72 v119,54.36 | C38.2 117.35,40.77 C37.2 114.91,40.79 v114.81,40.89 | C49.2 C45.2 | U10.1 114.17,50.55 113.91,50.29 | 128.24,16.76 U11.P$10 | R28.1 109.35,39.22 v109.6,38.96 | v102.31,54.02 102.23,53.95 C46.2 | 108.84,53.7 103.82,53.7 v103.72,53.79
  Top 0.254: C25.2 134.98,23.01 v135.13,22.86
  Top 0.305: C6.2 130.81,50.7 v130.81,51.56 | U4.2 U4.3 114.79,38.42 v114.81,38.44 | C52.2 C41.2 113.91,50.29 114.3,49.91 v114.89,49.91 | U1.57 121.54,46.23 v121.16,46.61 | U2.PAD v106.93,45.72 | C44.2 C43.2 108.84,53.7 C49.2 | C50.2 104.9,39.77 C48.2 | U11.P$1 117.49,25.61 116.81,26.29 v116.55,26.29 | U3.2 v124.77,36.45
  Top 0.406: v127.25,6.6 C20.2 | C27.2 112.96,19.3 v112.6,18.95
  Top 0.508: C17.2 117.42,37.27 v117.42,38.29
  Top 0.61: v131.57,40.64 134.15,40.64 134.57,41.06 J1.S1 | v131.83,51.56 131.86,51.59 J1.S2 | v138.68,39.37 138.56,39.5 138.56,41.31 J1.S3 | v132.08,42.93 132.44,43.28 J1.A1/B12 | v131.83,50.29 132.44,49.68 J1.B1/A12 | v138.43,54.1 138.5,54.03 J1.S4 | C16.2 123.19,33.41 123.05,33.27 v122.94,33.27 | C14.2 v101.09,6.86 | C15.2 v105.41,13.46 | U6.2 v106.93,10.16 | U$2.GND 105.89,27.15 v105.92,27.18 | 89.5,58.53 Q1.2
  Top 0.635: E2.GND@0 v133.6,35.05 | E2.GND@1 v133.6,29.97
  Top 0.813: Q16.2 12.19,57.42 v12.19,56.13 | Q15.2 18.35,58.23 17.78,57.66 v17.78,56.13 | Q13.2 28.51,58.23 27.94,57.66 v27.94,56.13 | Q14.2 22.86,57.93 v22.86,56.13 | Q1.2 88.9,57.93 v88.9,56.13 | Q2.2 83.57,57.68 v83.57,56.13 | Q3.2 78.49,57.68 v78.49,56.13 | Q4.2 73.41,57.68 v73.41,56.13 | Q5.2 68.33,57.68 v68.33,56.13 | Q6.2 63.25,57.68 v63.25,56.13 | Q7.2 58.17,57.68 v58.17,56.13 | Q8.2 53.09,57.68 v53.09,56.13 | Q9.2 48.01,57.68 v48.01,56.13 | Q10.2 43.18,57.93 v43.18,56.13 | Q11.2 37.85,57.68 v37.85,56.13 | Q12.2 32.77,57.68 v32.77,56.13
  Top 0.864: U$1.P$1 125.96,56.51
  Top 1.016: v5.08,49.53 5.08,46.53 | 5.08,46.53 5.08,37.9 | 5.08,37.9 5.08,27.23 | 5.08,27.23 5.08,17.07 C8.2 | C9.2 5.08,27.23 | C13.2 5.08,37.9 | C11.2 5.08,46.53 | C3.2 v95.5,49.02 | C4.2 v95.5,39.62 | C5.2 v95.5,28.96 | C10.2 v95.5,19.05
  Bottom 0.61: 101.6,29.97 101.6,26.92 | 123.44,30.48 123.44,27.48
  Bottom 0.813: v5.08,49.53 5.59,49.53 v12.19,56.13 v17.78,56.13 v22.86,56.13 v27.94,56.13 v32.77,56.13 v37.85,56.13 v43.18,56.13 v48.01,56.13 v53.09,56.13 v58.17,56.13 v63.25,56.13 v68.33,56.13 v73.41,56.13 v78.49,56.13 v83.57,56.13 v88.9,56.13 93.73,56.13 93.98,55.88
  Bottom 0.914: 93.98,55.88 95.5,54.36 v95.5,49.02 | v95.5,28.96 97.79,28.96 98.81,29.97 101.6,29.97
  Bottom 1.016: v95.5,49.02 v95.5,39.62 v95.5,28.96 v95.5,19.05
  other vias: 124.84,53.62 124.84,54.25 108.97,44.83 107.95,44.83 106.93,44.83 105.92,44.83 104.9,44.83 104.9,45.72 104.9,46.61 104.9,47.5 105.92,47.5 105.92,46.61 105.92,45.72 106.93,46.61 106.93,47.5 107.95,47.5 107.95,46.61 107.95,45.72 108.97,45.72 108.97,46.61 108.97,47.5 122.94,44.83 122.05,44.83 121.16,44.83 120.27,44.83 120.27,45.72 120.27,46.61 120.27,47.5 121.16,47.5 121.16,45.72 122.05,45.72 122.05,46.61 122.05,47.5 122.94,47.5 122.94,46.61 122.94,45.72 123.05,56.63 124.59,56.62 131.19,19.68 131.19,20.45 133.86,19.56 133.73,20.45 133.35,21.34 131.57,21.34 132.97,16.8 133.65,19.02 133.86,16.8 134.24,19.02 131.94,16.82 131.06,16.76 130.18,16.76 129.29,16.76 130.81,19.05 130.05,19.05 129.41,19.05 123.01,53.08 123,54.49 123.06,52.44 123.06,56.06 124.56,56.06 123.06,55.55 123.06,55.04 123,53.73 123.26,51.19 124.78,52.97 124.5,50.97
  pour Bottom: 110.17,0.71 138.99,0.71 138.99,27.74 110.07,27.74
  pour Top: 131.23,22 128.71,19.47 128.67,19.46 127.48,19.46 127.48,16.3 129.84,13.94 139.6,13.94 139.6,22
  pour Top: 118.14,15.9 127.99,15.9 127.99,26.14 118.14,26.14
  pour Bottom: 99.64,29.29 139.62,29.29 139.62,56.82 99.64,56.82
  pour Bottom: 100.03,0.71 108,0.71 108,27.23 100.03,27.23
GPIO0
  Top 0.152: U1.5 122.67,50.31 121.41,51.56 119.13,51.56 118.63,52.05 U10.2 118.49,54.01 118.39,54.1 118.39,54.77 118.62,54.99 R20.1
GPS-BKUP  (via drill 0.35)
  Top 0.152: U11.P$6 112.06,20.11 v112.01,20.07
  Top 0.406: R46.1 112.65,13.21 v112.65,14.86 112.7,14.82 112.7,8.17 C20.1
  Bottom 0.152: v112.01,20.07 112.04,20.04 112.04,15.48 v112.65,14.86
GPS-PPS  (via drill 0.35)
  Top 0.152: U2.44 102.47,45.48 v102.37,45.38 | v118.87,38.18 118.92,38.23 120.54,38.23 124.27,41.95 U1.42 | R47.2 134.24,27.94 114.55,27.94 v113.83,28.67 | v101.85,42.93 101.89,42.88 101.89,35.72 105.18,32.44 v110.77,32.44
  Top 0.305: R50.1 113.86,22.38 111.86,22.38 v111.81,22.42
  Bottom 0.152: v102.37,45.38 102.27,45.38 101.85,44.96 v101.85,42.93 | v118.87,38.18 118.87,33.47 113.95,28.55 | v111.81,22.42 111.85,22.45 112.02,22.45 111.58,22.9 111.58,26.18 113.95,28.55 | 113.95,28.55 v113.83,28.67 110.77,31.73 v110.77,32.44
GPS-RX  (via drill 0.35)
  Top 0.152: U1.48 125.63,45.63 126.6,44.66 v126.6,43.31
  Top 0.254: R49.1 112.57,23.79 v112.31,24.05
  Bottom 0.152: v112.31,24.05 112.31,26.12 126.6,40.4 v126.6,43.3 v126.6,43.31
GPS-TX  (via drill 0.35)
  Top 0.152: v127.13,43.74 127.13,44.52 125.62,46.03 U1.49
  Top 0.254: R55.1 113.86,25.33 v113.12,25.33
  Bottom 0.152: v113.12,25.33 113.12,26.53 127.13,40.54 v127.13,43.74
GPS_RESET  (via drill 0.35)
  Top 0.152: U1.37 122.27,41.24 120.65,39.62 v120.5,39.62 | 116.08,15.75 | 116.08,15.75 115.57,15.24 R98.2
  Top 0.203: U11.P$9 117.14,16.81 116.08,15.75 v116.4,16.07
  Bottom 0.152: v120.5,39.62 120.4,39.52 120.4,34.6 111.86,26.06 111.86,23.02 115.59,19.28 115.59,16.87 v116.4,16.07
HQ_OSC  (via drill 0.35)
  Top 0.152: U2.21 110.43,47.5 v111.76,47.5 | v104.39,30.91 104.39,28.11 101.89,25.61 U$2.OUT
  Bottom 0.152: v111.76,47.5 111,46.74 111,44.2 109.47,42.67 104.9,42.67 104.39,42.16 v104.39,30.91
LED0
  Top 0.635: Q1.3 87.88,53.76 87.88,45.97 | 87.88,45.97 87.88,35.81 | 87.88,35.81 87.88,25.65 | 87.88,25.65 87.88,16 88.65,15.24 D7.C | D6.C 88.14,25.4 87.88,25.65 | D5.C 88.14,35.56 87.88,35.81 | D4.C 88.14,45.72 87.88,45.97
LED1
  Top 0.635: Q2.3 82.8,53.76 82.8,45.72 | 82.8,45.72 82.8,35.31 | 82.8,35.31 82.8,25.15 | D12.C 83.06,25.4 82.8,25.15 | D15.C 83.06,35.56 82.8,35.31 | D13.C 82.81,45.72 82.8,45.72 | 82.8,25.15 82.8,15.75 83.31,15.24 D14.C
LED2
  Top 0.635: Q3.3 77.72,53.76 77.72,45.72 | 77.72,45.72 77.72,35.56 | 77.72,35.56 77.72,25.4 | D23.C 77.72,25.4 | D21.C 77.72,35.56 | D22.C 77.72,45.72 | 77.72,25.4 77.72,15.75 78.36,15.11 80.14,15.11 D20.C
LED3
  Top 0.635: Q4.3 72.64,53.76 72.64,45.72 | 72.64,45.72 72.64,35.31 | 72.64,35.31 72.64,25.4 | D30.C 72.64,25.4 | D29.C 72.9,35.56 72.64,35.31 | D31.C 72.64,45.72 | 72.64,25.4 72.64,16 73.41,15.24 D28.C
LED4
  Top 0.635: Q5.3 67.56,53.76 67.56,45.72 | 67.56,45.72 67.56,35.56 | 67.56,35.56 67.56,25.4 | D36.C 67.56,25.4 | D38.C 67.56,35.56 | D39.C 67.56,45.72 | 67.56,25.4 67.56,16 68.33,15.24 D37.C
LED5
  Top 0.635: Q6.3 62.48,53.76 62.48,45.72 | 62.48,45.72 62.48,35.56 | 62.48,35.56 62.48,25.4 | D46.C 62.48,25.4 | D45.C 62.48,35.56 | D44.C 62.48,45.72 | 62.48,25.4 62.48,16 63.25,15.24 D47.C
LED6
  Top 0.635: Q7.3 57.4,53.76 57.4,45.72 | 57.4,45.72 57.4,35.56 | 57.4,35.56 57.4,25.4 57.41,25.4 | D54.C 57.41,25.4 | D53.C 57.41,35.56 57.4,35.56 | D52.C 57.41,45.72 57.4,45.72 | 57.41,25.4 57.41,16.51 57.4,16.51 57.4,16 58.17,15.24 D55.C
LED7
  Top 0.635: Q8.3 52.32,53.76 52.32,45.72 | 52.32,45.72 52.32,35.56 | 52.32,35.56 52.32,25.4 | D60.C 52.33,25.4 52.32,25.4 | D63.C 52.33,35.56 52.32,35.56 | D62.C 52.33,45.72 52.32,45.72 | 52.32,25.4 52.32,16 53.09,15.24 D61.C
LED8
  Top 0.635: Q9.3 47.24,53.76 47.24,45.72 | 47.24,45.72 47.24,35.56 | 47.24,35.56 47.24,25.15 | D69.C 47.5,25.4 47.24,25.15 | D70.C 47.24,35.56 | D71.C 47.24,45.72 | 47.24,25.15 47.24,16 48.01,15.24 D68.C
LED9
  Top 0.635: Q10.3 42.16,53.76 42.16,45.72 | 42.16,45.72 42.16,35.56 | 42.16,35.56 42.16,25.4 | D76.C 42.16,25.4 | D77.C 42.16,35.56 | D79.C 42.16,45.72 | 42.16,25.4 42.16,16 42.93,15.24 D78.C
LED10
  Top 0.635: Q11.3 37.08,53.76 37.08,45.72 | 37.08,45.72 37.08,35.56 | 37.08,35.56 37.08,25.4 | D10.C 37.09,25.4 37.08,25.4 | D8.C 37.09,35.56 37.08,35.56 | D2.C 37.09,45.72 37.08,45.72 | 37.08,25.4 37.08,16 37.85,15.24 D11.C
LED11
  Top 0.635: Q12.3 32,53.76 32,45.47 | 32,45.47 32,35.56 | 32,35.56 32,25.4 32.01,25.4 | D18.C 32.01,25.4 | D17.C 32.01,35.56 32,35.56 | D16.C 32.26,45.72 32,45.47 | 32.01,25.4 32.01,16.51 32,16.51 32,16.26 33.02,15.24 D19.C
LED12
  Top 0.635: Q13.3 26.92,53.76 26.92,45.97 | 26.92,45.97 26.92,35.31 | 26.92,35.31 26.92,25.4 | D25.C 26.93,25.4 26.92,25.4 | D26.C 27.18,35.56 26.92,35.31 | D27.C 27.18,45.72 26.92,45.97 | 26.92,25.4 26.92,16.26 27.94,15.24 D24.C
LED13
  Top 0.635: Q14.3 21.84,53.76 21.84,45.72 | 21.84,45.72 21.84,35.56 | 21.84,35.56 21.84,25.4 | D33.C 21.84,25.4 | D34.C 21.84,35.56 | D35.C 21.84,45.72 | 21.84,25.4 21.84,16 22.61,15.24 D32.C
LED14
  Top 0.635: Q15.3 19.3,56.13 16.76,53.59 16.76,45.72 | 16.76,45.72 16.76,35.56 | 16.76,35.56 16.76,25.4 | D42.C 16.77,25.4 16.76,25.4 | D40.C 16.77,35.56 16.76,35.56 | D43.C 16.77,45.72 16.76,45.72 | 16.76,25.4 16.76,16.26 17.78,15.24 D41.C
LED15
  Top 0.635: 11.68,45.72 11.68,53.76 Q16.3 | 11.68,45.72 11.68,35.56 | 11.68,35.56 11.68,25.4 | D50.C 11.68,25.4 | D49.C 11.68,35.56 | D51.C 11.68,45.72 | 11.68,25.4 11.68,16 12.45,15.24 D48.C
LNA_IN
  Top 0.203: U1.2 123.87,50.46
  Top 0.508: 123.87,50.46 123.87,51.65 123.87,51.66 C1.1 L3.1
N$1
  Top 0.635: R2.1 D2.A
N$2
  Top 0.203: C6.1 R3.2 128.78,50.26 127.87,49.36 127.87,48.98 U5.IN/OUT
N$3
  Top 0.152: D1.A R23.2
N$5
  Top 0.635: R30.1 D8.A
N$6
  Top 0.635: R31.1 D10.A
N$7
  Top 0.635: R32.1 D11.A
N$8
  Top 0.635: D4.A R6.1
N$9
  Top 0.635: R7.1 D5.A
N$10
  Top 0.635: R8.1 D6.A
N$11
  Top 0.635: R9.1 D7.A
N$12
  Top 0.635: R37.1 D16.A
N$13
  Top 0.635: R38.1 D17.A
N$16
  Top 0.635: R15.1 D12.A
N$17
  Top 0.635: R16.1 D13.A
N$18
  Top 0.635: R17.1 D14.A
N$19
  Top 0.635: R18.1 D15.A
N$20
  Top 0.635: R39.1 D18.A
N$21
  Top 0.635: R40.1 D19.A
N$22
  Top 0.635: R41.1 D24.A
N$23
  Top 0.635: R56.1 D25.A
N$24
  Top 0.635: R57.1 D26.A
N$25
  Top 0.635: R24.1 D20.A
N$26
  Top 0.635: R25.1 D21.A
N$27
  Top 0.635: R26.1 D22.A
N$28
  Top 0.635: R27.1 D23.A
N$29
  Top 0.635: R58.1 D27.A
N$30
  Top 0.635: R59.1 D32.A
N$33
  Top 0.254: R84.1 129.67,21.21 U11.P$14
N$34
  Top 0.635: R33.1 D28.A
N$35
  Top 0.635: R34.1 D29.A
N$36
  Top 0.635: R35.1 D30.A
N$37
  Top 0.635: R36.1 D31.A
N$38
  Top 0.254: R84.2 131.64,24.06 132.59,24.06 | 132.59,24.06 132.46,24.02 FB1.2 | 132.59,24.06 133.59,24.06 C25.1
N$39
  Top 0.152: R47.1 138.67,26.42 D9.A
N$40
  Top 0.406: D3.1 110.8,13.26 110.8,13.27 R46.2
N$41
  Top 0.635: R64.1 D33.A
N$43
  Top 0.635: R42.1 D36.A
N$44
  Top 0.635: R43.1 D37.A
N$45
  Top 0.635: R44.1 D38.A
N$46
  Top 0.635: R45.1 D39.A
N$47
  Top 0.254: U11.P$4 116,22.31 R50.2
N$48
  Top 0.254: U11.P$3 115.42,23.41 R49.2
N$49
  Top 0.254: U11.P$2 118.06,24.64 116.87,24.64 116.86,24.67 116.26,25.27 R55.2
N$50
  Top 0.635: R65.1 D34.A
N$51
  Top 0.635: R66.1 D35.A
N$52
  Top 0.635: R51.1 D44.A
N$53
  Top 0.635: R52.1 D45.A
N$54
  Top 0.635: R53.1 D46.A
N$55
  Top 0.635: R54.1 D47.A
N$56
  Top 0.635: R75.1 D40.A
N$57
  Top 0.635: R76.1 D41.A
N$58
  Top 0.635: R77.1 D42.A
N$59
  Top 0.635: R82.1 D43.A
N$60
  Top 0.152: J1.A5 134.51,45.23 136.28,43.46 136.28,40.02 135.38,39.12 R97.2
N$61
  Top 0.635: R60.1 D52.A
N$62
  Top 0.635: R61.1 D53.A
N$63
  Top 0.635: R62.1 D54.A
N$64
  Top 0.635: R63.1 D55.A
N$66
  Top 0.152: J1.B5 135.66,48.23 136.91,46.99 136.91,39.99 134.76,37.85 R96.2
N$67
  Top 0.61: U6.5 102.04,9.21 101.09,10.16 101.09,13.46 | 101.09,13.46 101.09,16.53 U$2.VDD | 101.09,13.46 C15.1
N$69
  Top 0.635: R85.1 D48.A
N$70
  Top 0.635: R69.1 D60.A
N$71
  Top 0.635: R70.1 D61.A
N$72
  Top 0.635: R71.1 D62.A
N$73
  Top 0.635: D63.A R72.1
N$74
  Top 0.635: R86.1 D49.A
N$75
  Top 0.635: R91.1 D50.A
N$76
  Top 0.635: D51.A R92.1
N$79
  Top 0.635: R78.1 D68.A
N$80
  Top 0.635: R79.1 D69.A
N$81
  Top 0.635: R80.1 D70.A
N$82
  Top 0.635: R81.1 D71.A
N$88
  Top 0.635: R87.1 D76.A
N$89
  Top 0.635: R88.1 D77.A
N$90
  Top 0.635: R89.1 D78.A
N$91
  Top 0.635: R90.1 D79.A
OXCO_EN  (via drill 0.35)
  Top 0.152: U6.3 106.87,11.11 107.95,12.19 107.95,13.21 | R99.2 107.95,13.46 107.95,13.21 | v107.95,30.73 107.95,13.21 | U1.34 121.07,41.21 119.4,39.55 113.92,39.55 v113.79,39.68
  Bottom 0.152: v107.95,30.73 107.95,32.51 113.79,38.35 v113.79,39.68
RF-IN
  Top 0.305: 132.46,17.91 FB1.1 | 129.08,17.92 128.2,17.92 U11.P$11 | 137.03,17.91 E1.SIG
  Top 1.295: 137.03,17.91 132.46,17.91 | 129.08,17.92 FB1.1
RGB_0  (via drill 0.35)
  Top 0.152: U2.39 102.2,47.98 v101.92,48.26 | v136.4,37.36 136.93,37.36 137.21,37.64 U9.P$2
  Bottom 0.152: v136.4,37.36 136.38,37.36 132.64,41.1 132.24,41.1 128.64,44.7 125.5,44.7 124.18,43.38 118.67,43.38 113.74,48.31 113.74,50.48 112.2,52.02 102.85,52.02 101.41,50.59 101.41,48.77 v101.92,48.26
RGB_1  (via drill 0.35)
  Top 0.152: U2.40 102.06,47.48 v101.29,48.25 | v101.29,48.25 | v136.59,38.29 U9.P$3
  Bottom 0.152: v136.59,38.29 136.09,38.29 133.01,41.38 132.36,41.38 128.75,44.98 125.39,44.98 124.07,43.66 118.9,43.66 114.02,48.54 114.02,50.6 112.32,52.3 102.73,52.3 101.13,50.7 101.13,48.65 101.29,48.5 v101.29,48.25
RGB_2  (via drill 0.35)
  Top 0.152: U2.41 101.36,46.98 v101.09,47.24 | v137.16,39.12 137.92,39.12 138.38,38.66 138.38,38.27
  Top 0.203: 138.38,38.27 U9.P$4
  Bottom 0.152: v101.09,47.24 100.76,47.58 100.76,50.72 102.62,52.58 112.52,52.58 114.3,50.8 114.3,48.77 119.13,43.94 123.95,43.94 125.27,45.26 128.87,45.26 132.47,41.66 133.37,41.66 135.91,39.12 v137.16,39.12
USB_D+  (via drill 0.35)
  Top 0.152: U1.26 117.01,44.43 116.47,43.89 v116.47,43.3 | 132.84,46.23 132.59,46.49 132.59,46.99 132.83,47.23 J1.B6 | 132.84,46.23 131.93,46.23 127.54,41.84 v125.78,41.84 | 132.84,46.23 J1.A6
  Bottom 0.152: v116.47,43.3 116.47,42.8 117.42,41.84 v125.78,41.84
USB_D-  (via drill 0.35)
  Top 0.152: U1.25 116,44.83 115.55,44.38 v115.55,43.25 | v125.09,41.15 127.38,41.15 131.97,45.73 J1.B7 135.27,45.73 135.53,46 135.53,46.47 135.27,46.73 J1.A7
  Bottom 0.152: v115.55,43.25 115.62,43.25 117.31,41.56 124.68,41.56 v125.09,41.15
VDD_CPU_MAIN
  Top 0.152: 120.98,53.83 L1.2
  Top 0.203: U1.4 123.07,50.54 | 123.07,50.54 123.47,50.14 U1.3 | 123.07,50.54 122.16,51.45 121.97,51.45 121.1,52.32 C34.1
  Top 0.305: C34.1 C35.1 120.98,53.83
XTAL_N
  Top 0.152: U5.OUT/IN 129.05,46.31 128.72,45.98 127.78,45.98 C7.1 126.82,46.44 126.82,46.92 126.56,47.19 126.54,47.19 126.5,47.23 U1.52
XTAL_P
  Top 0.152: R3.1 127.42,50.42 126.84,49.85 126.84,47.63 U1.53